# EAGLE schematic FillControl (EAGLE 9.5.1)

## Sheet 1 of 2
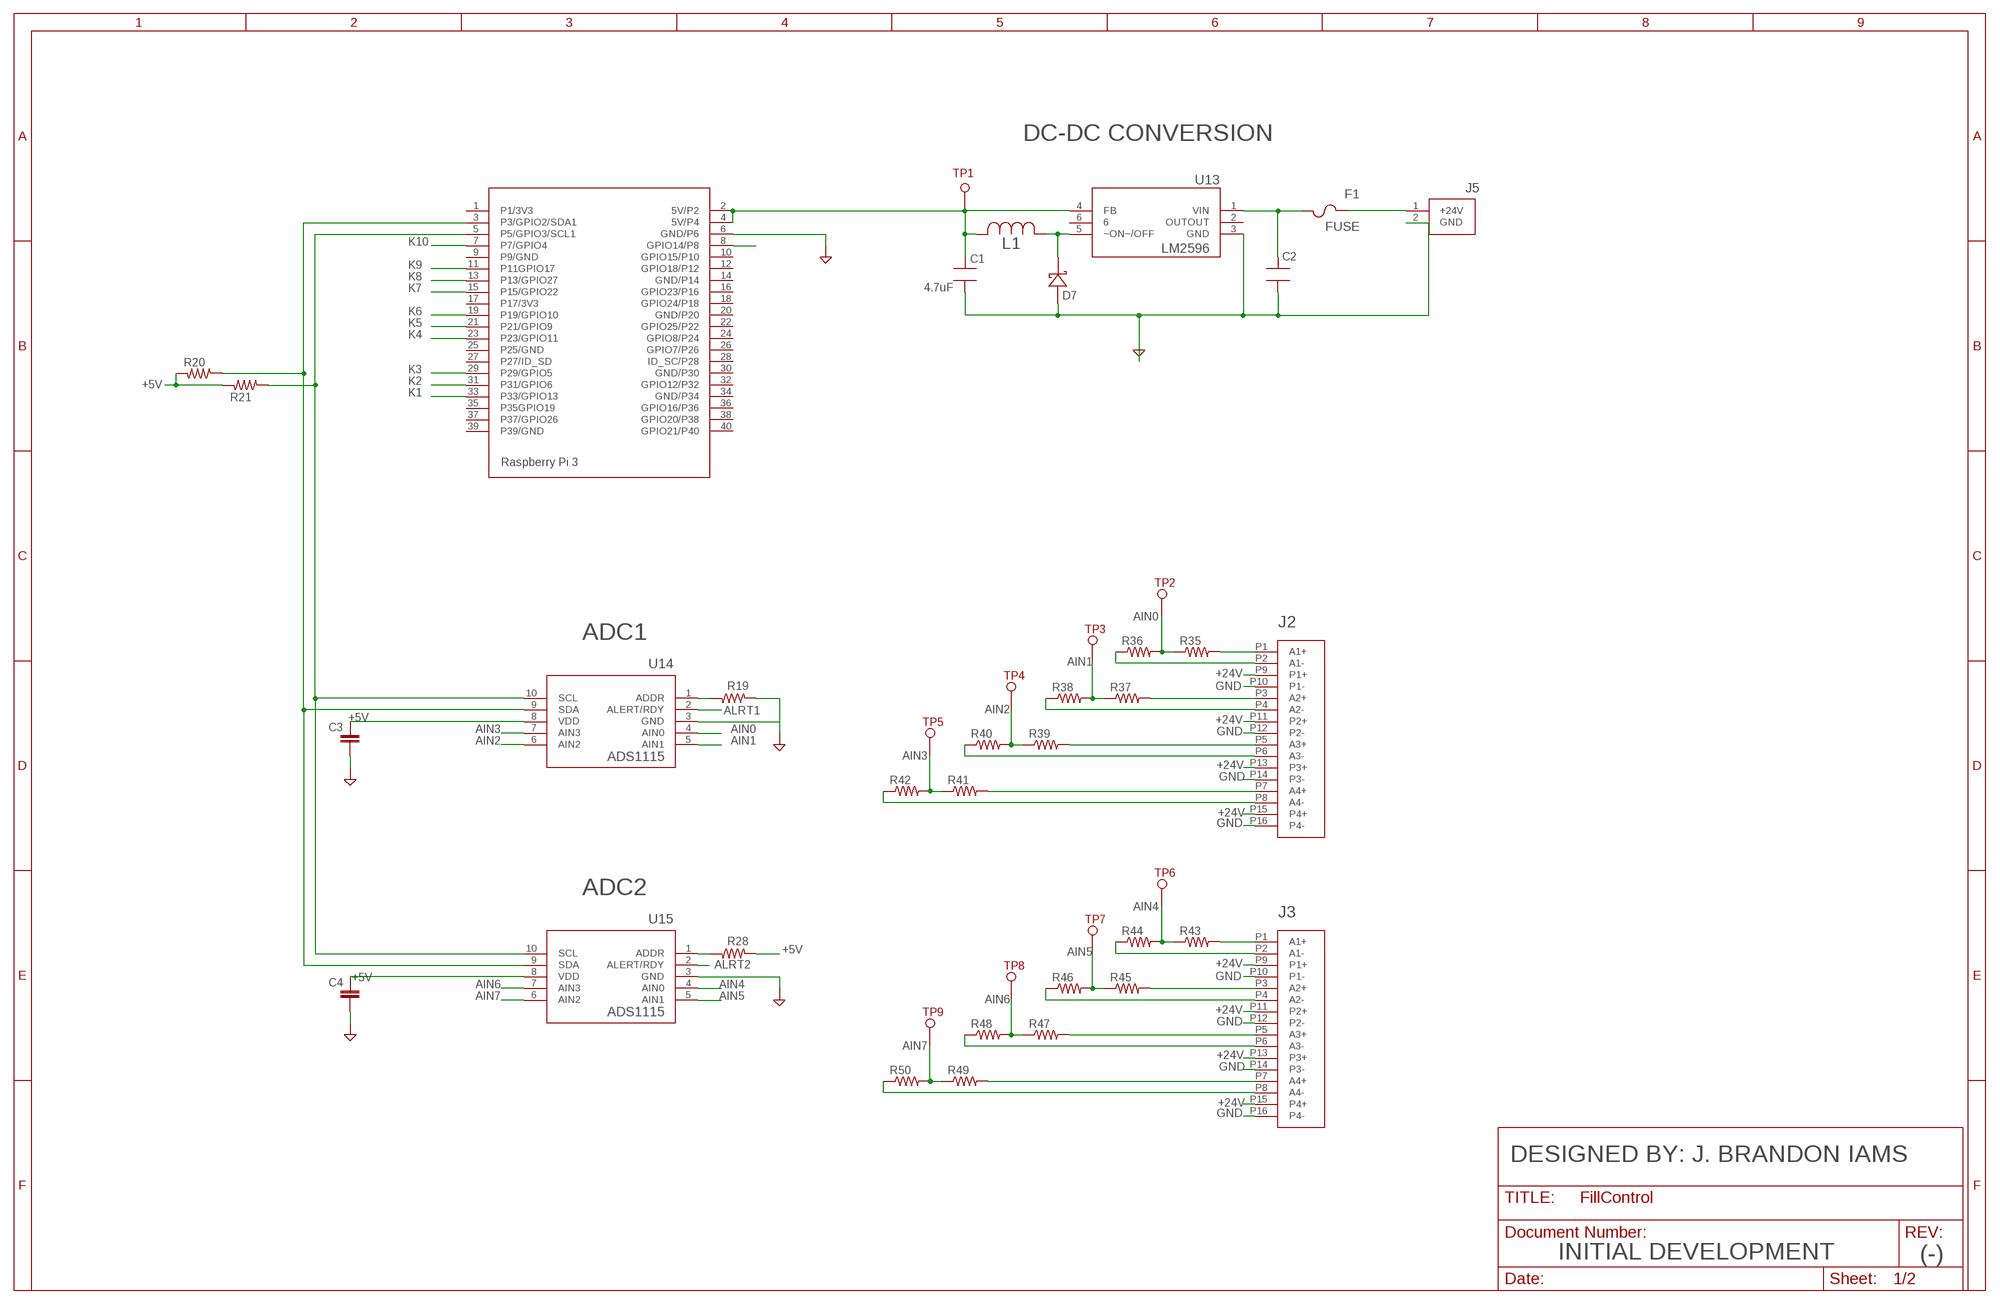
[diagram p0: schematic, sheet 1]

### Parts
C1  4.7uF  CAP_4.7  [CAP_UCD_8X6P2]
C2  CAP_18  [CAP_ULH_10X10]
C3  C-EUC0402  [C0402]
C4  C-EUC0402  [C0402]
D7  SHOTKEY  [SMC]
F1  FUSE  [FUS_VISHAY_MFU0805]
J1  RASPBERRY-PI  [2X20_FEMALE_HEADER]
J2  16POS_CONN  [16POS_MOLEX]
J3  16POS_CONN  [16POS_MOLEX]
J5  2POS_SCREW  [2POS_BLOCK]
L1  INDUCTOR_SRR1210-680M  [IND_BOURNS_SRR1210]
R19  R-US_R0603  [R0603]
R20  R-US_R0603  [R0603]
R21  R-US_R0603  [R0603]
R28  R-US_R0603  [R0603]
R35  R-US_R0603  [R0603]
R36  R-US_R0603  [R0603]
R37  R-US_R0603  [R0603]
R38  R-US_R0603  [R0603]
R39  R-US_R0603  [R0603]
R40  R-US_R0603  [R0603]
R41  R-US_R0603  [R0603]
R42  R-US_R0603  [R0603]
R43  R-US_R0603  [R0603]
R44  R-US_R0603  [R0603]
R45  R-US_R0603  [R0603]
R46  R-US_R0603  [R0603]
R47  R-US_R0603  [R0603]
R48  R-US_R0603  [R0603]
R49  R-US_R0603  [R0603]
R50  R-US_R0603  [R0603]
TP1  TESTPOINT  [TESTPOINT]
TP2  TESTPOINT  [TESTPOINT]
TP3  TESTPOINT  [TESTPOINT]
TP4  TESTPOINT  [TESTPOINT]
TP5  TESTPOINT  [TESTPOINT]
TP6  TESTPOINT  [TESTPOINT]
TP7  TESTPOINT  [TESTPOINT]
TP8  TESTPOINT  [TESTPOINT]
TP9  TESTPOINT  [TESTPOINT]
U13  LM2596SX-5.0/NOPB  [TS5B]
U14  ADS1115IDGSR  [DGS10]
U15  ADS1115IDGSR  [DGS10]

### Nets
+5V: C1.1 C3.1 C4.1 J1.2(5V/P2) J1.4(5V/P4) L1.1 R20.2 R21.2 R28.2 TP1.P$1 U13.4(FB) U14.8(VDD) U15.8(VDD) ; also sheet 2
+24V: F1.1 J2.P9(P1+) J2.P11(P2+) J2.P13(P3+) J2.P15(P4+) J3.P9(P1+) J3.P11(P2+) J3.P13(P3+) J3.P15(P4+) J5.1(+24V) ; also sheet 2
AIN0: R35.1 R36.2 TP2.P$1 U14.4(AIN0)
AIN1: R37.1 R38.2 TP3.P$1 U14.5(AIN1)
AIN2: R39.1 R40.2 TP4.P$1 U14.6(AIN2)
AIN3: R41.1 R42.2 TP5.P$1 U14.7(AIN3)
AIN4: R43.1 R44.2 TP6.P$1 U15.4(AIN0)
AIN5: R45.1 R46.2 TP7.P$1 U15.5(AIN1)
AIN6: R47.1 R48.2 TP8.P$1 U15.7(AIN3)
AIN7: R49.1 R50.2 TP9.P$1 U15.6(AIN2)
ALRT1: U14.2(ALERT/RDY)
ALRT2: U15.2(ALERT/RDY)
GND: C1.2 C2.2 C3.2 C4.2 D7.2 J1.6(GND/P6) J2.P10(P1-) J2.P12(P2-) J2.P14(P3-) J2.P16(P4-) J3.P10(P1-) J3.P12(P2-) J3.P14(P3-) J3.P16(P4-) J5.2(GND) U13.3(GND) U15.3(GND) ; also sheet 2
K1: J1.33(P33/GPIO13) ; also sheet 2
K2: J1.31(P31/GPIO6) ; also sheet 2
K3: J1.29(P29/GPIO5) ; also sheet 2
K4: J1.23(P23/GPIO11) ; also sheet 2
K5: J1.21(P21/GPIO9) ; also sheet 2
K6: J1.19(P19/GPIO10) ; also sheet 2
K7: J1.15(P15/GPIO22) ; also sheet 2
K8: J1.13(P13/GPIO27) ; also sheet 2
K9: J1.11(P11GPIO17) ; also sheet 2
K10: J1.7(P7/GPIO4) ; also sheet 2
N$7: J2.P2(A1-) R36.1
N$9: J2.P3(A2+) R37.2
N$10: J2.P4(A2-) R38.1
N$12: J2.P6(A3-) R40.1
N$14: J2.P5(A3+) R39.2
N$17: J2.P7(A4+) R41.2
N$18: J2.P8(A4-) R42.1
N$37: D7.1 L1.2 U13.5(~ON~/OFF)
N$38: J3.P1(A1+) R43.2
N$40: C2.1 F1.2 U13.1(VIN)
N$42: R19.1 U14.1(ADDR)
N$53: R28.1 U15.1(ADDR)
N$56: R19.2 U14.3(GND) ; supply symbol labelled GND
N$71: J2.P1(A1+) R35.2
N$77: J3.P2(A1-) R44.1
N$78: J3.P3(A2+) R45.2
N$79: J3.P4(A2-) R46.1
N$80: J3.P6(A3-) R48.1
N$81: J3.P5(A3+) R47.2
N$82: J3.P7(A4+) R49.2
N$83: J3.P8(A4-) R50.1
N$87: J1.8(GPIO14/P8)
SCL: J1.5(P5/GPIO3/SCL1) R21.1 U14.10(SCL) U15.10(SCL)
SDA: J1.3(P3/GPIO2/SDA1) R20.1 U14.9(SDA) U15.9(SDA)
Unconnected: J1.1(P1/3V3) J1.9(P9/GND) J1.10(GPIO15/P10) J1.12(GPIO18/P12) J1.14(GND/P14) J1.16(GPIO23/P16) J1.17(P17/3V3) J1.18(GPIO24/P18) J1.20(GND/P20) J1.22(GPIO25/P22) J1.24(GPIO8/P24) J1.25(P25/GND) J1.26(GPIO7/P26) J1.27(P27/ID_SD) J1.28(ID_SC/P28) J1.30(GND/P30) J1.32(GPIO12/P32) J1.34(GND/P34) J1.35(P35GPIO19) J1.36(GPIO16/P36) J1.37(P37/GPIO26) J1.38(GPIO20/P38) J1.39(P39/GND) J1.40(GPIO21/P40) U13.2(OUTOUT) U13.6

### Notes on the sheet
- DC-DC CONVERSION
- ADC1
- ADC2
- DESIGNED BY: J. BRANDON IAMS
- INITIAL DEVELOPMENT | (-)

## Sheet 2 of 2
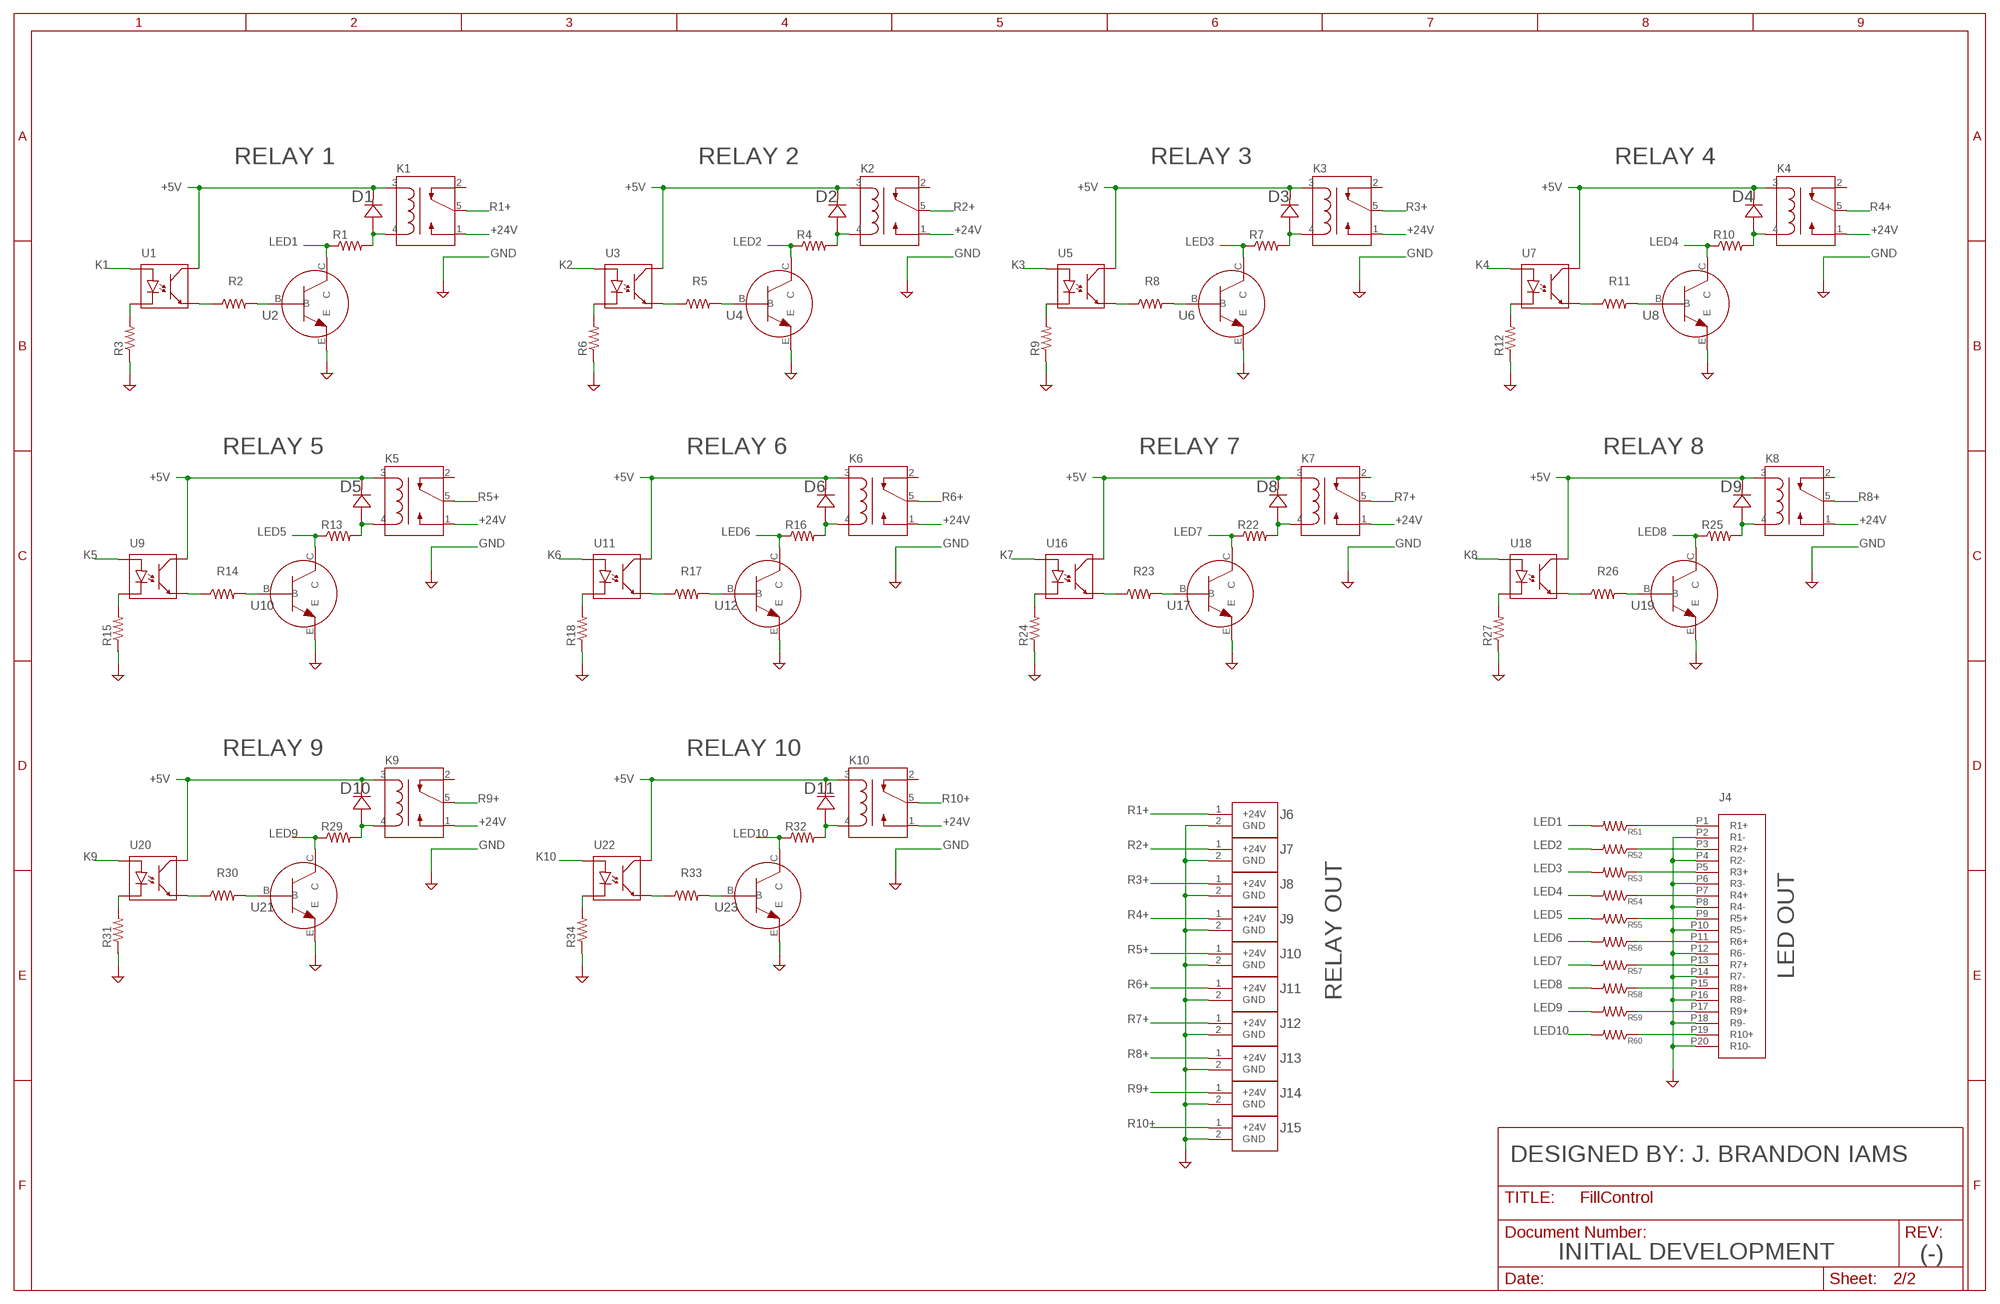
[diagram p1: schematic, sheet 2]

### Parts
D1  DIODE  [DIODE_SOD323]
D2  DIODE  [DIODE_SOD323]
D3  DIODE  [DIODE_SOD323]
D4  DIODE  [DIODE_SOD323]
D5  DIODE  [DIODE_SOD323]
D6  DIODE  [DIODE_SOD323]
D8  DIODE  [DIODE_SOD323]
D9  DIODE  [DIODE_SOD323]
D10  DIODE  [DIODE_SOD323]
D11  DIODE  [DIODE_SOD323]
J4  20POS_MOLEX  [20POS_MOLEX]
J6  2POS_SCREW  [2POS_BLOCK]
J7  2POS_SCREW  [2POS_BLOCK]
J8  2POS_SCREW  [2POS_BLOCK]
J9  2POS_SCREW  [2POS_BLOCK]
J10  2POS_SCREW  [2POS_BLOCK]
J11  2POS_SCREW  [2POS_BLOCK]
J12  2POS_SCREW  [2POS_BLOCK]
J13  2POS_SCREW  [2POS_BLOCK]
J14  2POS_SCREW  [2POS_BLOCK]
J15  2POS_SCREW  [2POS_BLOCK]
K1  RELAY  [RELAY_1-1721150-0]
K2  RELAY  [RELAY_1-1721150-0]
K3  RELAY  [RELAY_1-1721150-0]
K4  RELAY  [RELAY_1-1721150-0]
K5  RELAY  [RELAY_1-1721150-0]
K6  RELAY  [RELAY_1-1721150-0]
K7  RELAY  [RELAY_1-1721150-0]
K8  RELAY  [RELAY_1-1721150-0]
K9  RELAY  [RELAY_1-1721150-0]
K10  RELAY  [RELAY_1-1721150-0]
R1  R-US_R0603  [R0603]
R2  R-US_R0603  [R0603]
R3  R-US_R0603  [R0603]
R4  R-US_R0603  [R0603]
R5  R-US_R0603  [R0603]
R6  R-US_R0603  [R0603]
R7  R-US_R0603  [R0603]
R8  R-US_R0603  [R0603]
R9  R-US_R0603  [R0603]
R10  R-US_R0603  [R0603]
R11  R-US_R0603  [R0603]
R12  R-US_R0603  [R0603]
R13  R-US_R0603  [R0603]
R14  R-US_R0603  [R0603]
R15  R-US_R0603  [R0603]
R16  R-US_R0603  [R0603]
R17  R-US_R0603  [R0603]
R18  R-US_R0603  [R0603]
R22  R-US_R0603  [R0603]
R23  R-US_R0603  [R0603]
R24  R-US_R0603  [R0603]
R25  R-US_R0603  [R0603]
R26  R-US_R0603  [R0603]
R27  R-US_R0603  [R0603]
R29  R-US_R0603  [R0603]
R30  R-US_R0603  [R0603]
R31  R-US_R0603  [R0603]
R32  R-US_R0603  [R0603]
R33  R-US_R0603  [R0603]
R34  R-US_R0603  [R0603]
R51  R-US_R0603  [R0603]
R52  R-US_R0603  [R0603]
R53  R-US_R0603  [R0603]
R54  R-US_R0603  [R0603]
R55  R-US_R0603  [R0603]
R56  R-US_R0603  [R0603]
R57  R-US_R0603  [R0603]
R58  R-US_R0603  [R0603]
R59  R-US_R0603  [R0603]
R60  R-US_R0603  [R0603]
U1  OPTOISOLATOR  [SOP-4L_TC]
U2  NPN_BJT  [SOT-23]
U3  OPTOISOLATOR  [SOP-4L_TC]
U4  NPN_BJT  [SOT-23]
U5  OPTOISOLATOR  [SOP-4L_TC]
U6  NPN_BJT  [SOT-23]
U7  OPTOISOLATOR  [SOP-4L_TC]
U8  NPN_BJT  [SOT-23]
U9  OPTOISOLATOR  [SOP-4L_TC]
U10  NPN_BJT  [SOT-23]
U11  OPTOISOLATOR  [SOP-4L_TC]
U12  NPN_BJT  [SOT-23]
U16  OPTOISOLATOR  [SOP-4L_TC]
U17  NPN_BJT  [SOT-23]
U18  OPTOISOLATOR  [SOP-4L_TC]
U19  NPN_BJT  [SOT-23]
U20  OPTOISOLATOR  [SOP-4L_TC]
U21  NPN_BJT  [SOT-23]
U22  OPTOISOLATOR  [SOP-4L_TC]
U23  NPN_BJT  [SOT-23]

### Nets
+5V: D1.1 D2.1 D3.1 D4.1 D5.1 D6.1 D8.1 D9.1 D10.1 D11.1 K1.3 K2.3 K3.3 K4.3 K5.3 K6.3 K7.3 K8.3 K9.3 K10.3 U1.4 U3.4 U5.4 U7.4 U9.4 U11.4 U16.4 U18.4 U20.4 U22.4 ; also sheet 1
+24V: K1.1 K2.1 K3.1 K4.1 K5.1 K6.1 K7.1 K8.1 K9.1 K10.1 ; also sheet 1
GND: J4.P2(R1-) J4.P4(R2-) J4.P6(R3-) J4.P8(R4-) J4.P10(R5-) J4.P12(R6-) J4.P14(R7-) J4.P16(R8-) J4.P18(R9-) J4.P20(R10-) J6.2(GND) J7.2(GND) J8.2(GND) J9.2(GND) J10.2(GND) J11.2(GND) J12.2(GND) J13.2(GND) J14.2(GND) J15.2(GND) R3.1 R6.1 R9.1 R12.1 R15.1 R18.1 R24.1 R27.1 R31.1 R34.1 U2.E U4.E U6.E U8.E U10.E U12.E U17.E U19.E U21.E U23.E ; also sheet 1
K1: U1.1 ; also sheet 1
K2: U3.1 ; also sheet 1
K3: U5.1 ; also sheet 1
K4: U7.1 ; also sheet 1
K5: U9.1 ; also sheet 1
K6: U11.1 ; also sheet 1
K7: U16.1 ; also sheet 1
K8: U18.1 ; also sheet 1
K9: U20.1 ; also sheet 1
K10: U22.1 ; also sheet 1
LED1: R1.1 R51.2 U2.C
LED2: R4.1 R52.2 U4.C
LED3: R7.1 R53.2 U6.C
LED4: R10.1 R54.2 U8.C
LED5: R13.1 R55.2 U10.C
LED6: R16.1 R56.2 U12.C
LED7: R22.1 R57.2 U17.C
LED8: R25.1 R58.2 U19.C
LED9: R29.1 R59.2 U21.C
LED10: R32.1 R60.2 U23.C
N$1: R2.1 U1.3
N$2: D1.2 K1.4 R1.2
N$3: R2.2 U2.B
N$4: J4.P1(R1+) R51.1
N$5: R3.2 U1.2
N$6: J4.P5(R3+) R53.1
N$8: D2.2 K2.4 R4.2
N$11: R5.1 U3.3
N$13: R5.2 U4.B
N$15: J4.P3(R2+) R52.1
N$16: R6.2 U3.2
N$19: J4.P7(R4+) R54.1
N$20: D3.2 K3.4 R7.2
N$21: R8.1 U5.3
N$22: R8.2 U6.B
N$23: J4.P9(R5+) R55.1
N$24: R9.2 U5.2
N$25: J4.P11(R6+) R56.1
N$26: D4.2 K4.4 R10.2
N$27: R11.1 U7.3
N$28: R11.2 U8.B
N$29: J4.P13(R7+) R57.1
N$30: R12.2 U7.2
N$31: J4.P15(R8+) R58.1
N$32: D5.2 K5.4 R13.2
N$33: R14.1 U9.3
N$34: R14.2 U10.B
N$35: J4.P17(R9+) R59.1
N$36: R15.2 U9.2
N$39: J4.P19(R10+) R60.1
N$41: D6.2 K6.4 R16.2
N$43: R17.1 U11.3
N$44: R17.2 U12.B
N$46: R18.2 U11.2
N$48: D8.2 K7.4 R22.2
N$49: R23.1 U16.3
N$50: R23.2 U17.B
N$52: R24.2 U16.2
N$55: D9.2 K8.4 R25.2
N$59: R26.1 U18.3
N$60: R26.2 U19.B
N$62: R27.2 U18.2
N$64: D10.2 K9.4 R29.2
N$65: R30.1 U20.3
N$66: R30.2 U21.B
N$68: R31.2 U20.2
N$70: D11.2 K10.4 R32.2
N$72: R33.1 U22.3
N$73: R33.2 U23.B
N$75: R34.2 U22.2
R1+: J6.1(+24V) K1.5
R2+: J7.1(+24V) K2.5
R3+: J8.1(+24V) K3.5
R4+: J9.1(+24V) K4.5
R5+: J10.1(+24V) K5.5
R6+: J11.1(+24V) K6.5
R7+: J12.1(+24V) K7.5
R8+: J13.1(+24V) K8.5
R9+: J14.1(+24V) K9.5
R10+: J15.1(+24V) K10.5
Unconnected: K1.2 K2.2 K3.2 K4.2 K5.2 K6.2 K7.2 K8.2 K9.2 K10.2

### Notes on the sheet
- RELAY 1 | RELAY 2 | RELAY 3 | RELAY 4
- RELAY 5 | RELAY 6 | RELAY 7 | RELAY 8
- RELAY 9 | RELAY 10
- RELAY OUT
- LED OUT
- DESIGNED BY: J. BRANDON IAMS
- INITIAL DEVELOPMENT | (-)

## Library data of the parts
C1 = FillControl:CAP_4.7; MANUFACTURER_PART_NUMBER: UUX2A4R7MCL1GS; VENDOR: Nichicon
C2 = FillControl:CAP_18; MANUFACTURER_PART_NUMBER: ULT2D180MNL1GS; VENDOR: Nichicon
C3 C4 = rcl:C-EU: CAPACITOR, European symbol; SPICEPREFIX: C
D1-D6 D8-D11 = FillControl:DIODE
D7 = FillControl:SHOTKEY
F1 = FillControl:FUSE; MANUFACTURER_PART_NUMBER: MFU0805FF02000P100; VENDOR: VISHAY
J1 = FillControl:RASPBERRY-PI
J2 J3 = MICROCONTROLLER:16POS_CONN
J4 = MICROCONTROLLER:20POS_MOLEX
J5-J15 = MICROCONTROLLER:2POS_SCREW; MANUFACTURER_PART_NUMBER: 2828472; VENDOR: TE Connectivity
K1-K10 = FillControl:RELAY
L1 = FillControl:INDUCTOR_SRR1210-680M; MANUFACTURER_PART_NUMBER: SRR1210680M; VENDOR: Bourns Electronics
R1-R60 = rcl:R-US_: RESISTOR, American symbol; SPICEPREFIX: R
TP1-TP9 = MICROCONTROLLER:TESTPOINT
U1 U3 U5 U7 U9 U11 U16 U18 U20 U22 = FillControl:OPTOISOLATOR
U2 U4 U6 U8 U10 U12 U17 U19 U21 U23 = FillControl:NPN_BJT
U13 = FillControl:LM2596SX-5.0/NOPB; MANUFACTURER_PART_NUMBER: LM2596SX5.0NOPB; VENDOR: Texas Instruments
U14 U15 = FillControl:ADS1115IDGSR; MANUFACTURER_PART_NUMBER: ADS1115IDGSR; VENDOR: Texas Instruments